# EAGLE design P2N-001 (EAGLE 7.1.0)
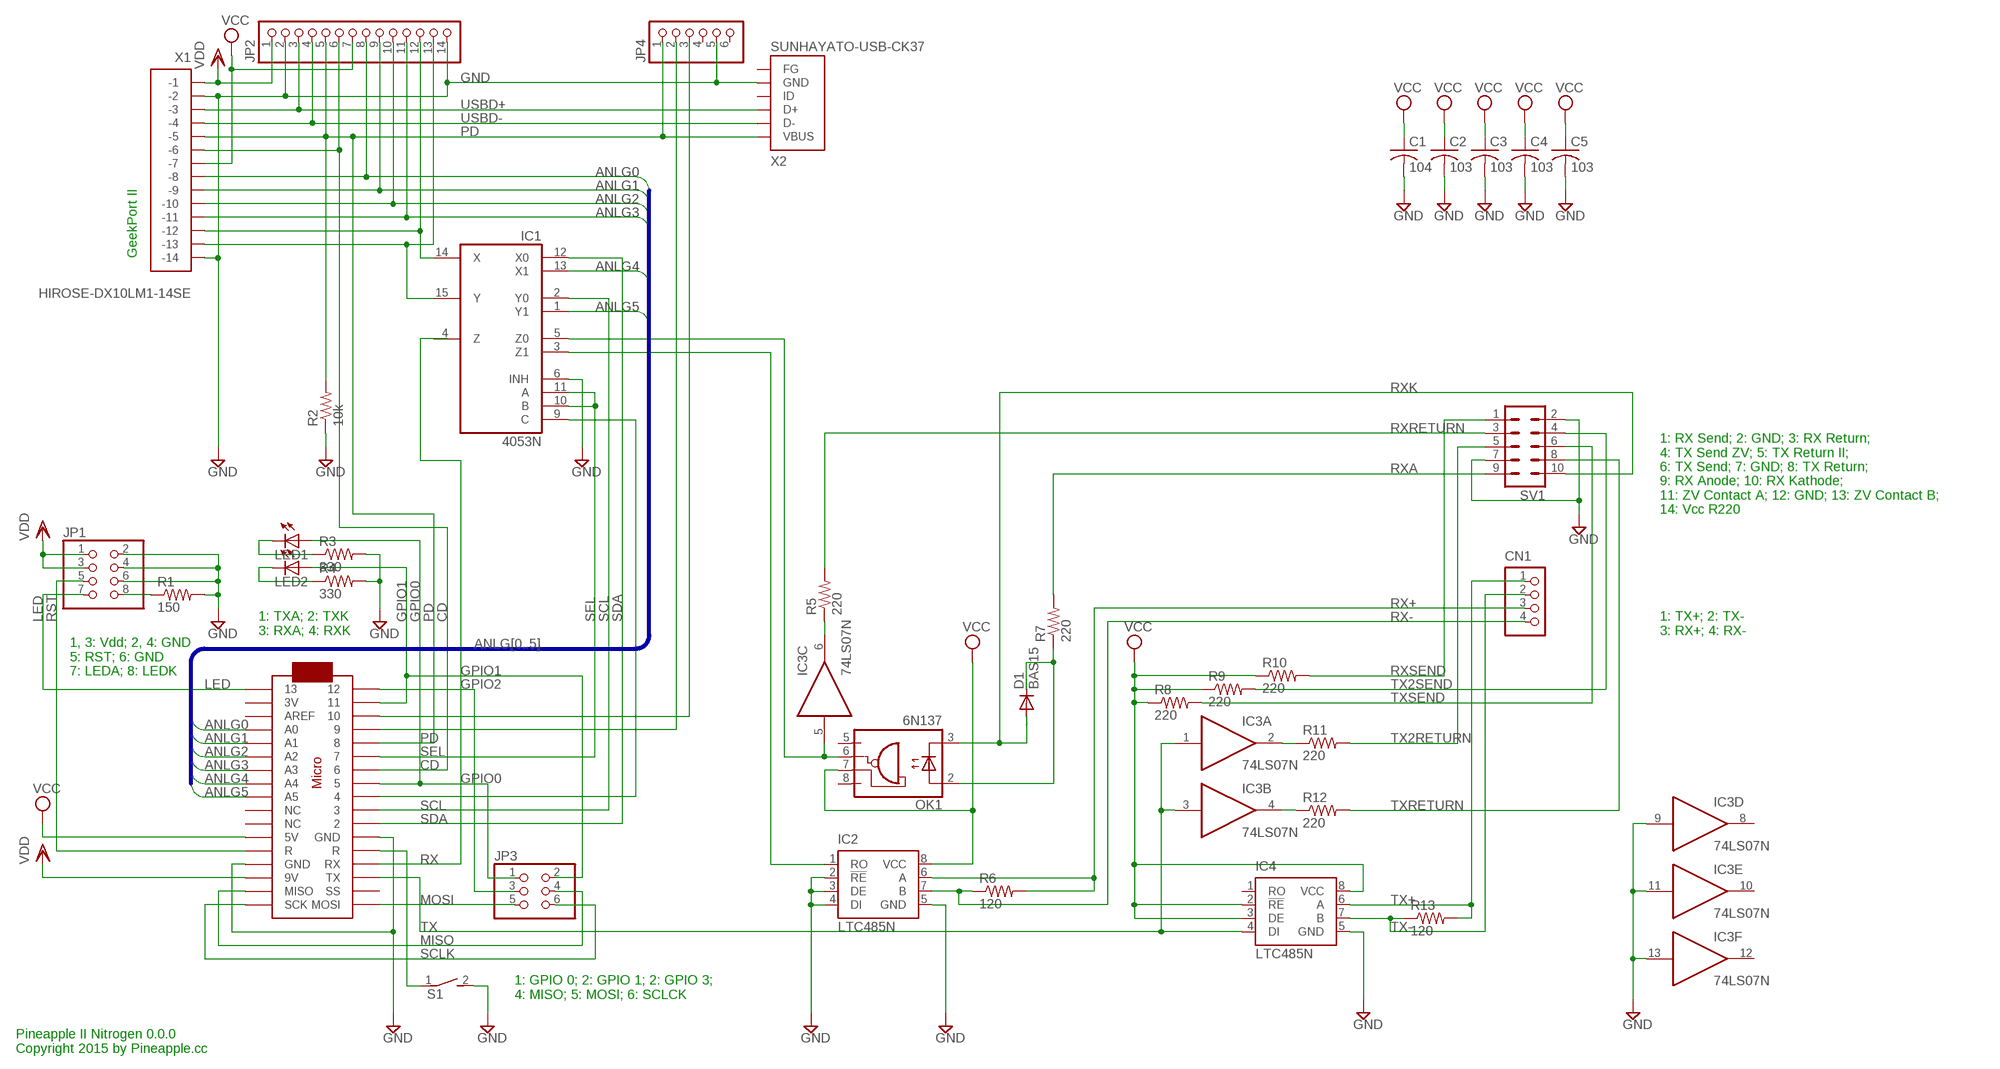
[diagram p0: schematic, sheet 1]

## Parts
C1  104  C-US025-025X050  [C025-025X050]
C2  103  C-US025-025X050  [C025-025X050]
C3  103  C-US025-025X050  [C025-025X050]
C4  103  C-US025-025X050  [C025-025X050]
C5  103  C-US025-025X050  [C025-025X050]
CN1  S4B-PH-K-S  [S4B-PH-K-S]
D1  BAS15  [DO34-7]
IC1  4053N  [DIL16]
IC2  LTC485N  [DIL08]
IC3  74LS07N  [DIL14]
IC4  LTC485N  [DIL08]
JP1  PINHD-2X4  [2X04]
JP2  PINHD-1X14-CB  [1X14-CB]
JP3  PINHD-2X3  [2X03]
JP4  PINHD-1X6  [1X06]
LED1  LED3MM  [LED3MM]
LED2  LED3MM  [LED3MM]
MC1  ARDUINOMICRO  [ARDUINOMICRO]
OK1  6N137  [DIL08]
R1  150  R-US_0204/5  [0204/5]
R2  10k  R-US_0204/5  [0204/5]
R3  330  R-US_0204/5  [0204/5]
R4  330  R-US_0204/5  [0204/5]
R5  220  R-US_0204/5  [0204/5]
R6  120  R-US_0204/5  [0204/5]
R7  220  R-US_0204/5  [0204/5]
R8  220  R-US_0204/5  [0204/5]
R9  220  R-US_0204/5  [0204/5]
R10  220  R-US_0204/5  [0204/5]
R11  220  R-US_0204/5  [0204/5]
R12  220  R-US_0204/5  [0204/5]
R13  120  R-US_0204/5  [0204/5]
S1  DS01E  [DS-01]
SV1  ML10L  [ML10L]
X1  HIROSE-DX10LM1-14SE  [HIROSE-DX10LM1-14SE]
X2  SUNHAYATO-USB-CK37  [SUNHAYATO-USB-CK37]

## Nets
ANLG0: JP2.8 MC1.P$31(A0) X1.P$8(-8)
ANLG1: JP2.9 MC1.P$30(A1) X1.P$9(-9)
ANLG2: JP2.10 MC1.P$29(A2) X1.P$10(-10)
ANLG3: JP2.11 MC1.P$28(A3) X1.P$11(-11)
ANLG4: IC1.13(X1) MC1.P$27(A4)
ANLG5: IC1.1(Y1) MC1.P$26(A5)
CD: JP2.6 MC1.P$7 X1.P$6(-6)
GND: C1.2 C2.2 C3.2 C4.2 C5.2 IC1.6(INH) IC2.2(!RE) IC2.3(DE) IC2.4(DI) IC2.5(GND) IC3.9(D:I) IC3.11(E:I) IC3.13(F:I) IC4.5(GND) JP1.2 JP1.4 JP1.6 JP2.2 JP2.14 JP4.5 MC1.P$12(GND) MC1.P$21(GND) R1.2 R2.1 R3.2 R4.2 S1.2 SV1.2 SV1.7 X1.P$2(-2) X1.P$14(-14) X2.P$5(GND)
GPIO0: JP3.1 LED1.A MC1.P$8
GPIO1: JP3.2 LED2.A MC1.P$2
GPIO2: JP3.3 MC1.P$1
LED: JP1.7 MC1.P$34
MIDIRX: IC1.5(Z0) IC3.5(C:I) OK1.6(VO)
MISO: JP3.4 MC1.P$19(MISO)
MOSI: JP3.5 MC1.P$17(MOSI)
N$1: MC1.P$22(R) S1.1
N$2: IC3.2(A:O) R11.1
N$3: IC3.6(C:O) R5.1
N$4: IC3.4(B:O) R12.1
N$5: JP4.2 MC1.P$4
N$6: JP4.3 MC1.P$3
N$8: IC1.9(C) MC1.P$9
N$15: D1.C OK1.2(A) R7.1
N$17: LED1.K(C) R3.1
N$18: LED2.K(C) R4.1
N$28: IC1.14(X) JP2.12 X1.P$12(-12)
N$29: IC1.15(Y) JP2.13 X1.P$13(-13)
N$32: JP1.8 R1.1
PD: JP2.5 JP4.1 MC1.P$5 R2.2 X1.P$5(-5) X2.P$1(VBUS)
RST: JP1.5 MC1.P$13(R)
RX: MC1.P$14(RX)
RX+: CN1.3 IC2.6(A) R6.2
RX-: CN1.4 IC2.7(B) R6.1
RXA: R7.2 SV1.9
RXK: D1.A OK1.3(C) SV1.10
RXRETURN: R5.2 SV1.3
RXSEND: R10.2 SV1.1
SCL: IC1.2(Y0) MC1.P$10
SCLK: JP3.6 MC1.P$18(SCK)
SDA: IC1.12(X0) MC1.P$11
SEL: IC1.10(B) IC1.11(A) MC1.P$6
TX: IC3.1(A:I) IC3.3(B:I) IC4.4(DI) MC1.P$15(TX)
TX2RETURN: R11.2 SV1.5
TX2SEND: R9.2 SV1.4
TX+: CN1.1 IC4.6(A) R13.2
TX-: CN1.2 IC4.7(B) R13.1
TXRETURN: R12.2 SV1.8
TXSEND: R8.2 SV1.6
USBD+: JP2.3 X1.P$3(-3) X2.P$3(D+)
USBD-: JP2.4 X1.P$4(-4) X2.P$2(D-)
VCC: C1.1 C2.1 C3.1 C4.1 C5.1 IC2.8(VCC) IC4.2(!RE) IC4.3(DE) IC4.8(VCC) JP2.7 MC1.P$23(5V) OK1.7(VE) R8.1 R9.1 R10.1 X1.P$7(-7)
VDD: JP1.1 JP1.3 JP2.1 MC1.P$20(9V) X1.P$1(-1)
XMIDIRX: IC1.3(Z1) IC2.1(RO)
Unconnected: IC1.4(Z) IC3.8(D:O) IC3.10(E:O) IC3.12(F:O) IC4.1(RO) JP4.4 JP4.6 MC1.P$16(SS) MC1.P$24(NC) MC1.P$25(NC) MC1.P$32(AREF) MC1.P$33(3V) OK1.5(GND) OK1.8(VCC) X2.P$4(ID) X2.P$6(FG)

## Buses
ANLG[0..5]

## Notes on the sheet
- GeekPort II
- 1: RX Send; 2: GND; 3: RX Return;
  4: TX Send ZV; 5: TX Return II;
  6: TX Send; 7: GND; 8: TX Return;
  9: RX Anode; 10: RX Kathode;
  11: ZV Contact A; 12: GND; 13: ZV Contact B;
  14: Vcc R220
- 1: TXA; 2: TXK
  3: RXA; 4: RXK
- 1: TX+; 2: TX-
  3: RX+; 4: RX-
- 1, 3: Vdd; 2, 4: GND
  5: RST; 6: GND
  7: LEDA; 8: LEDK
- 1: GPIO 0; 2: GPIO 1; 2: GPIO 3;
  4: MISO; 5: MOSI; 6: SCLCK
- Pineapple II Nitrogen 0.0.0
  Copyright 2015 by Pineapple.cc

## Power pins joined to a net without a drawn wire
GND: IC1.8(GND) IC3.7(P:GND)
VCC: IC1.16(VCC) IC3.14(P:VCC)
VEE: IC1.7(VEE)

## Library data of the parts
C1-C5 = rcl:C-US: CAPACITOR, American symbol
CN1 = jst-ph:S4B-PH-*: Wire-to-Board 2.0mm pitch side mount connector Source: http://www.jst-mfg.com/product/pdf/jpn/PH.pdf http://www.jst-mfg.com/product/detail.php?series=199
D1 = diode:BAS15: DIODE high speed
IC1 = 40xx:4053: Triple 2-channel ANALOG MULTIPLEXER
IC2 IC4 = linear-technology:LTC485: Low Power RS485 Interface Transceiver Source: http://www.linear.com/pc/downloadDocument.do?navId=H0,C1,C1007,C1017,P2064,D1718; OC_FARNELL: unknown; OC_NEWARK: unknown
IC3 = 74xx-us:74*07: Hex BUFFER, open collector high-voltage output
JP1 = pinhead:PINHD-2X4: PIN HEADER
JP2 = adafruit:PINHD-1X14: PIN HEADER
JP3 = pinhead:PINHD-2X3: PIN HEADER
JP4 = adafruit:PINHD-1X6: PIN HEADER
LED1 LED2 = led:LED: LED OSRAM: - CHIPLED LG R971, LG N971, LY N971, LG Q971, LY Q971, LO R971, LY R971 LH N974, LH R974 LS Q976, LO Q976, LY Q976 LO Q996 - Hyper CHIPLED LW Q18S LB Q993, LB Q99A, LB R99A - SideLED LS A670, LO A670, LY A670, LG A670, LP A670 LB A673, LV A673, LT A673, LW A673 LH A674 LY A675 LS A676, LA A676, LO A676, LY A676, LW A676 LS A679, LY A679, LG A679 - Hyper Micro SIDELED® LS Y876, LA Y876, LO Y876, LY Y876 LT Y87S - SmartLED LW L88C, LW L88S LB L89C, LB L89S, LG L890 LS L89K, LO L89K, LY L89K LS L896, LA L896, LO L896, LY L896 - TOPLED LS T670, LO T670, LY T670, LG T670, LP T670 LSG T670, LSP T670, LSY T670, LOP T670, LYG T670 LG T671, LOG T671, LSG T671 LB T673, LV T673, LT T673, LW T673 LH T674 LS T676, LA T676, LO T676, LY T676, LB T676, LH T676, LSB T676, LW T676 LB T67C, LV T67C, LT T67C, LS T67K, LO T67K, LY T67K, LW E67C LS E67B, LA E67B, LO E67B, LY E67B, LB E67C, LV E67C, LT E67C LW T67C LS T679, LY T679, LG T679 LS T770, LO T770, LY T770, LG T770, LP T770 LB T773, LV T773, LT T773, LW T773 LH T774 LS E675, LA E675, LY E675, LS T675 LS T776, LA T776, LO T776, LY T776, LB T776 LHGB T686 LT T68C, LB T68C - Hyper Mini TOPLED® LB M676 - Mini TOPLED Santana® LG M470 LS M47K, LO M47K, LY M47K Source: http://www.osram.convergy.de LUXEON: - LUMILED® LXK2-PW12-R00, LXK2-PW12-S00, LXK2-PW14-U00, LXK2-PW14-V00 LXK2-PM12-R00, LXK2-PM12-S00, LXK2-PM14-U00 LXK2-PE12-Q00, LXK2-PE12-R00, LXK2-PE12-S00, LXK2-PE14-T00, LXK2-PE14-U00 LXK2-PB12-K00, LXK2-PB12-L00, LXK2-PB12-M00, LXK2-PB14-N00, LXK2-PB14-P00, LXK2-PB14-Q00 LXK2-PR12-L00, LXK2-PR12-M00, LXK2-PR14-Q00, LXK2-PR14-R00 LXK2-PD12-Q00, LXK2-PD12-R00, LXK2-PD12-S00 LXK2-PH12-R00, LXK2-PH12-S00 LXK2-PL12-P00, LXK2-PL12-Q00, LXK2-PL12-R00 Source: www.luxeon.com KINGBRIGHT: KA-3528ASYC Source: www.kingbright.com
MC1 = adafruit:ARDUINOMICRO
OK1 = optocoupler:6N137: MOTOROLA OPTO COUPLER; MPN: 6N137; OC_FARNELL: 1328376; OC_NEWARK: 52M1895
R1-R13 = resistor:R-US_: RESISTOR, American symbol
S1 = switch-dil:DS01E: DIL/CODE SWITCH; OC_FARNELL: unknown; OC_NEWARK: unknown
SV1 = con-ml:ML10L: HARTING; OC_FARNELL: unknown; OC_NEWARK: unknown
X1 = con-hirose-dx10lm1-14se:HIROSE-DX10LM1-14SE: AXR30545 Plug (Board mounting type) B type Source: http://www.panasonic-electric-works.ch/home/www/catalogues/connector/download/en_ds_65201_0000.pdf; MPN: AXR30545; OC_FARNELL: unknown; OC_NEWARK: 11N4069
X2 = con-sunhayato-usb:SUNHAYATO-USB-CK37: AXR30545 Plug (Board mounting type) B type Source: http://www.panasonic-electric-works.ch/home/www/catalogues/connector/download/en_ds_65201_0000.pdf; MPN: AXR30545; OC_FARNELL: unknown; OC_NEWARK: 11N4069

## Board
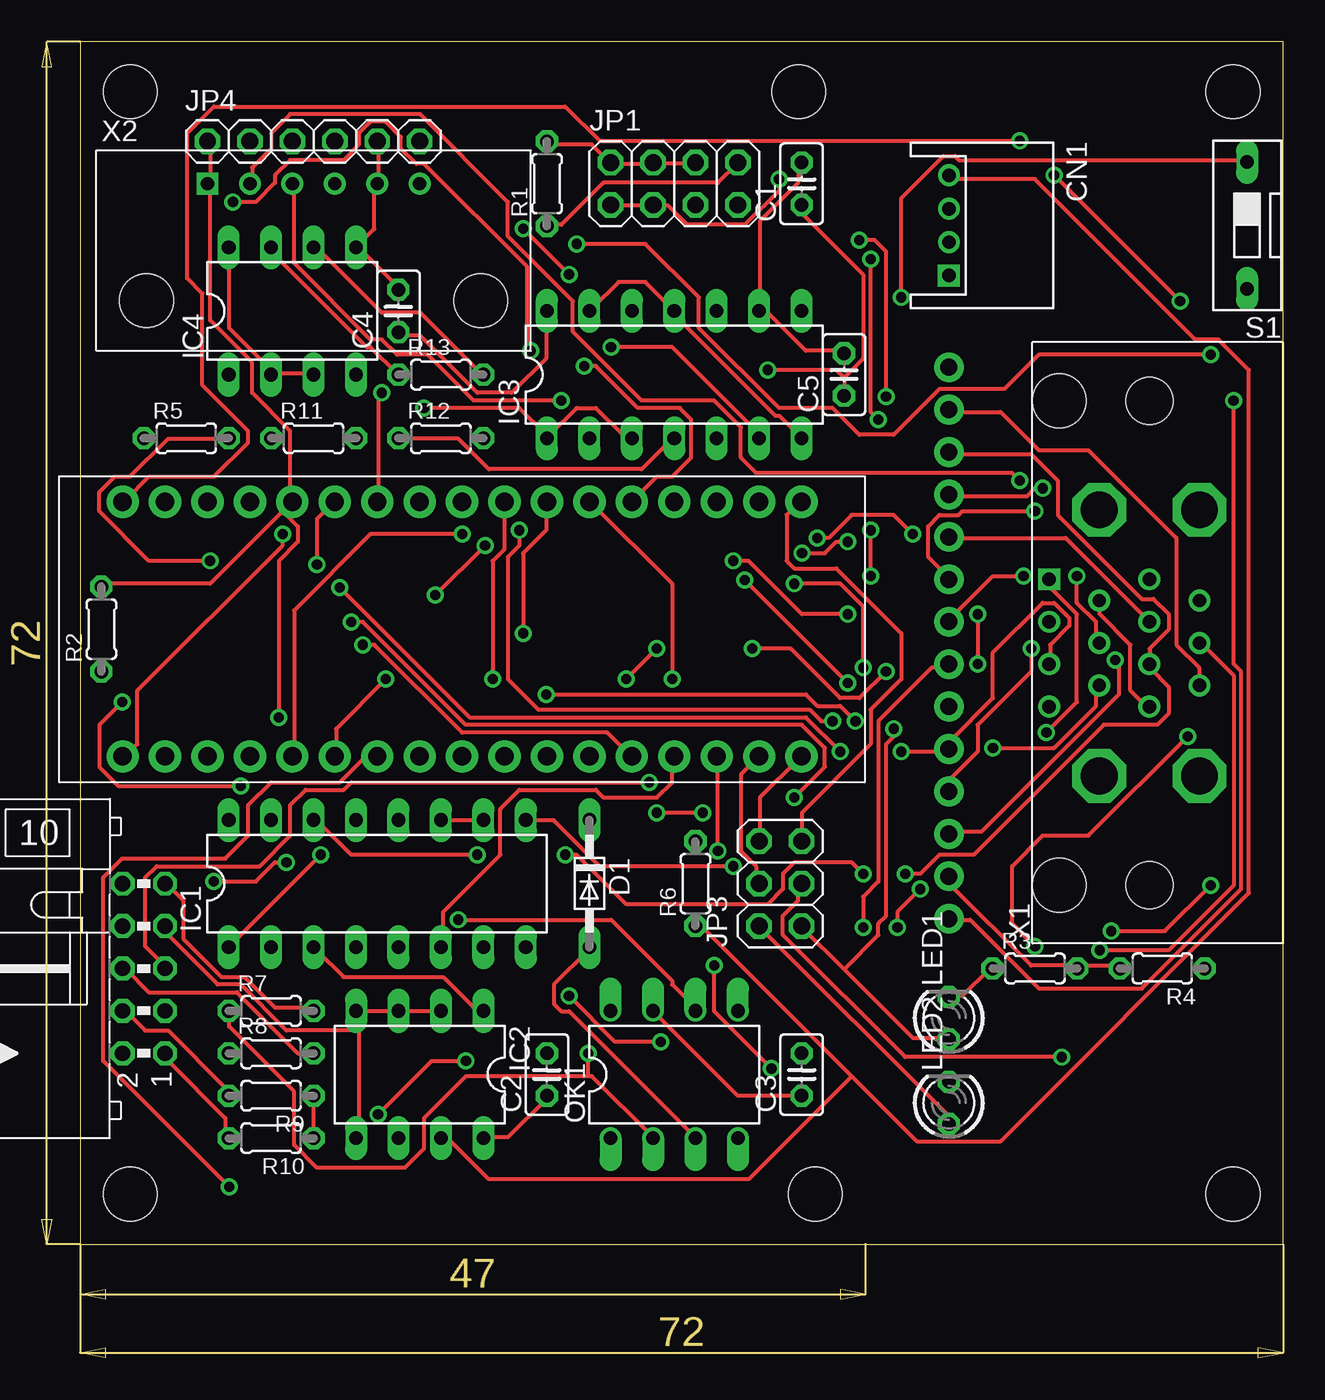
[diagram p1: board, top side]
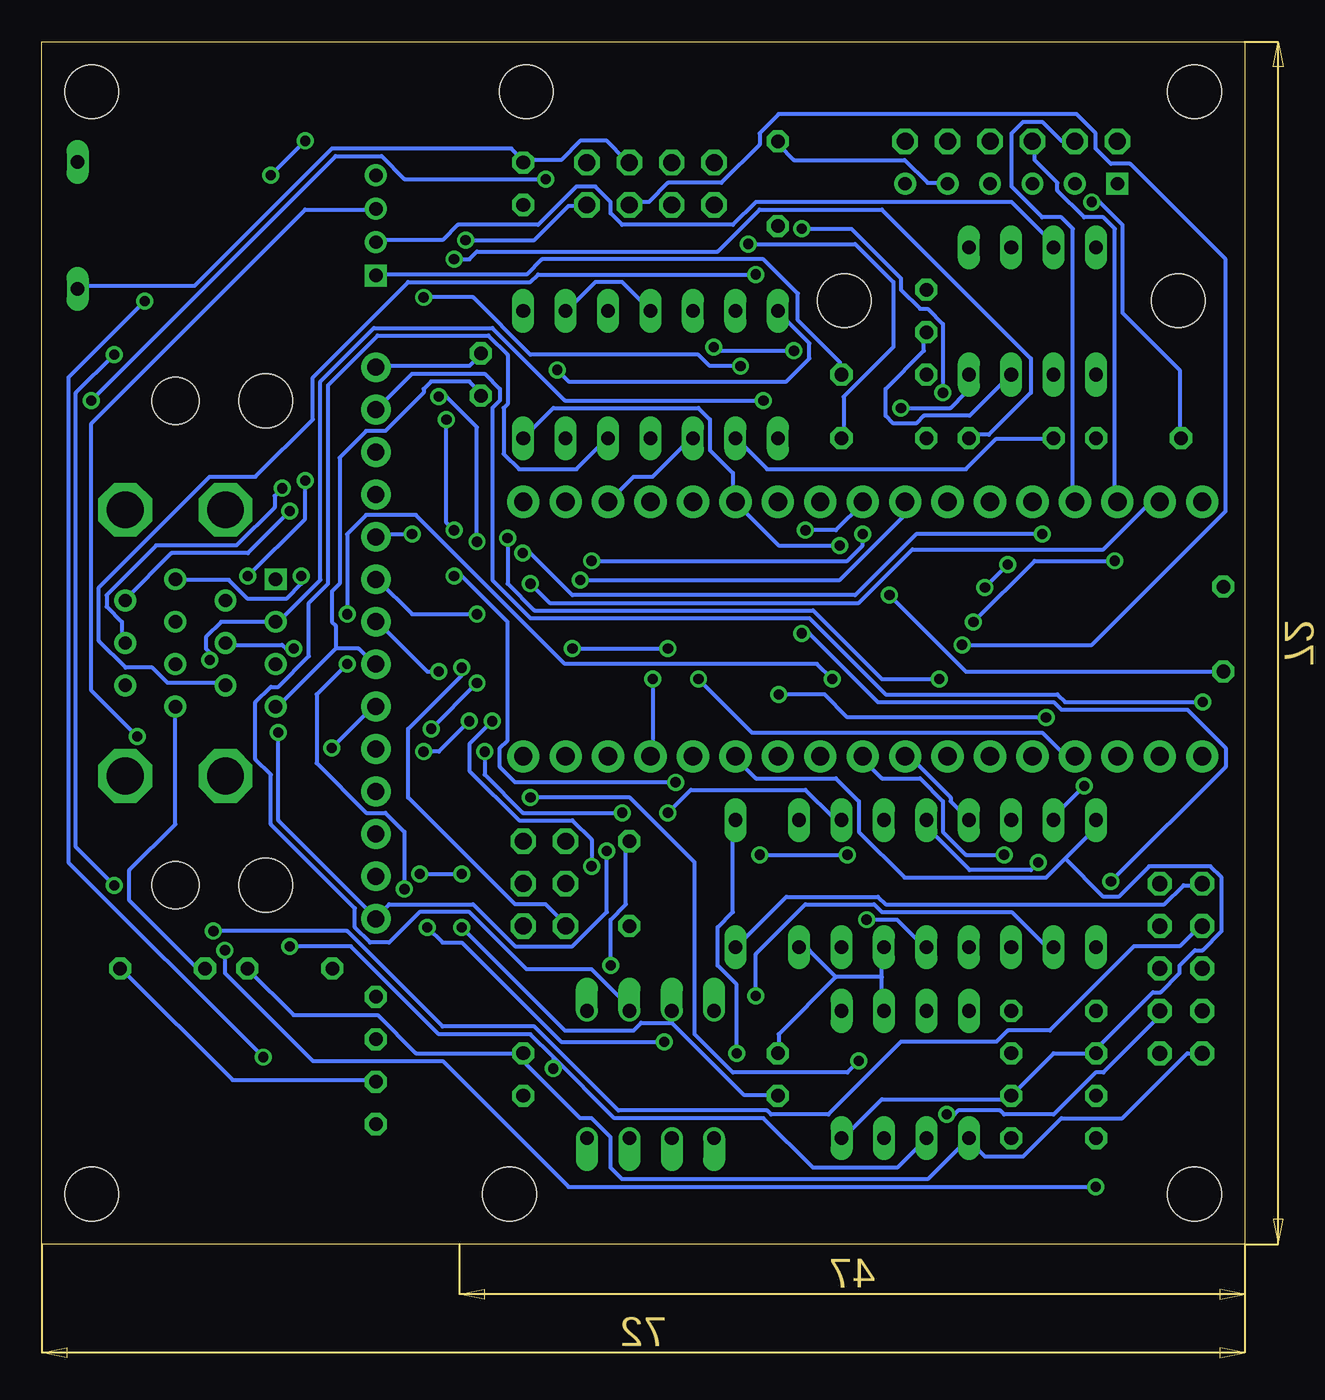
[diagram p2: board, bottom side, seen from below]

Size 72 x 72 mm. Coordinates in mm from the lower left corner, seen from the top.
Outline: 0,0 72,0 72,72 0,72 0,0
Copper layers (1*16): Top 0.035mm / dielectric 1.5mm / Bottom 0.035mm
Design rules "default": minimum track width 10mil, minimum drill 24mil, track to track 8mil, track to pad 8mil, pad to pad 8mil, via to via 8mil, smd to smd 8mil, copper to edge 40mil, drill to drill 8mil, minimum pad ring 10mil, minimum via ring 8mil, stop-mask expansion 4mil, vias tented up to drill 0mil, thermal gap 10mil
Holes 3.2 mm at 3,3 3,69 69,3 69,69 44,3 43,69

### Footprints (pad centres in the part's own frame; a part is rotated, then mirrored left to right if it is on the bottom)
C025-025X050 = drill 0.813 octagon: 1 -1.27,0; 2 1.27,0
S4B-PH-K-S = drill 0.8 square: 1 3,0 | drill 0.8: 2 1,0; 3 -1,0; 4 -3,0
DO34-7 = drill 0.813 long: A 3.81,0; C -3.81,0
DIL16 = drill 0.813 long: 1 -8.89,-3.81; 2 -6.35,-3.81; 3 -3.81,-3.81; 4 -1.27,-3.81; 5 1.27,-3.81; 6 3.81,-3.81; 7 6.35,-3.81; 8 8.89,-3.81; 9 8.89,3.81; 10 6.35,3.81; 11 3.81,3.81; 12 1.27,3.81; 13 -1.27,3.81; 14 -3.81,3.81; 15 -6.35,3.81; 16 -8.89,3.81
DIL08 = drill 0.813 long: 1 -3.81,-3.81; 2 -1.27,-3.81; 3 1.27,-3.81; 4 3.81,-3.81; 5 3.81,3.81; 6 1.27,3.81; 7 -1.27,3.81; 8 -3.81,3.81
DIL14 = drill 0.813 long: 1 -7.62,-3.81; 2 -5.08,-3.81; 3 -2.54,-3.81; 4 0,-3.81; 5 2.54,-3.81; 6 5.08,-3.81; 7 7.62,-3.81; 8 7.62,3.81; 9 5.08,3.81; 10 2.54,3.81; 11 0,3.81; 12 -2.54,3.81; 13 -5.08,3.81; 14 -7.62,3.81
2X04 = drill 1.016 octagon: 1 -3.81,-1.27; 2 -3.81,1.27; 3 -1.27,-1.27; 4 -1.27,1.27; 5 1.27,-1.27; 6 1.27,1.27; 7 3.81,-1.27; 8 3.81,1.27
1X14-CB = drill 1.016 pad 1.778: 1 -16.51,0; 2 -13.97,0; 3 -11.43,0; 4 -8.89,0; 5 -6.35,0; 6 -3.81,0; 7 -1.27,0; 8 1.27,0; 9 3.81,0; 10 6.35,0; 11 8.89,0; 12 11.43,0; 13 13.97,0; 14 16.51,0
2X03 = drill 1.016 octagon: 1 -2.54,-1.27; 2 -2.54,1.27; 3 0,-1.27; 4 0,1.27; 5 2.54,-1.27; 6 2.54,1.27
1X06 = drill 1.016 octagon: 1 -6.35,0; 2 -3.81,0; 3 -1.27,0; 4 1.27,0; 5 3.81,0; 6 6.35,0
LED3MM = drill 0.813 octagon: A -1.27,0; K 1.27,0
ARDUINOMICRO = drill 1.1 pad 1.93: P$1 -20.32,7.62; P$2 -17.78,7.62; P$3 -15.24,7.62; P$4 -12.7,7.62; P$5 -10.16,7.62; P$6 -7.62,7.62; P$7 -5.08,7.62; P$8 -2.54,7.62; P$9 0,7.62; P$10 2.54,7.62; P$11 5.08,7.62; P$12 12.7,-7.62; P$13 10.16,-7.62; P$14 12.7,7.62; P$15 15.24,7.62; P$16 17.78,7.62; P$17 20.32,7.62; P$18 20.32,-7.62; P$19 17.78,-7.62; P$20 15.24,-7.62; P$21 7.62,7.62; P$22 10.16,7.62; P$23 7.62,-7.62; P$24 5.08,-7.62; P$25 2.54,-7.62; P$26 0,-7.62; P$27 -2.54,-7.62; P$28 -5.08,-7.62; P$29 -7.62,-7.62; P$30 -10.16,-7.62; P$31 -12.7,-7.62; P$32 -15.24,-7.62; P$33 -17.78,-7.62; P$34 -20.32,-7.62
DIL08' = drill 0.813 offset: 1 -3.81,-3.81; 2 -1.27,-3.81; 3 1.27,-3.81; 4 3.81,-3.81; 5 3.81,3.81; 6 1.27,3.81; 7 -1.27,3.81; 8 -3.81,3.81
0204/5 = drill 0.813 octagon: 1 -2.54,0; 2 2.54,0
DS-01 = drill 0.813 long: 1 0,-3.81; 2 0,3.81
ML10L = drill 0.914 octagon: 1 -5.08,-1.27; 2 -5.08,1.27; 3 -2.54,-1.27; 4 -2.54,1.27; 5 0,-1.27; 6 0,1.27; 7 2.54,-1.27; 8 2.54,1.27; 9 5.08,-1.27; 10 5.08,1.27
HIROSE-DX10LM1-14SE = drill 0.8 square: P$1 3.81,9 | drill 0.8: P$2 2.54,6; P$3 1.27,9; P$4 0,6; P$5 -1.27,9; P$6 -2.54,6; P$7 -3.81,9; P$8 3.81,3; P$9 2.54,0; P$10 1.27,3; P$11 0,0; P$12 -1.27,3; P$13 -2.54,0; P$14 -3.81,3 | drill 2.2 octagon: P$15 -7.97,0; P$16 7.97,0; P$17 7.97,6; P$18 -7.97,6 | hole 2.8: -14.5,3; 14.5,3 | hole 3.2: -14.5,8.4; 14.5,8.4
SUNHAYATO-USB-CK37 = drill 0.8 square: P$1 -6.35,0 | drill 0.8: P$2 -3.81,0; P$3 -1.27,0; P$4 1.27,0; P$5 3.81,0; P$6 6.35,0 | hole 3.2: -10,-7; 10,-7

### Placement (x,y rotation side)
C1  43.18,63.5 90 top
C2  27.94,10.16 90 top
C3  43.18,10.16 90 top
C4  19.05,55.88 90 top
C5  45.72,52.07 90 top
CN1  52,61 270 top
D1  30.48,21.59 270 top
IC1  17.78,21.59 0 top
IC2  20.32,10.16 180 top
IC3  35.56,52.07 0 top
IC4  12.7,55.88 0 top
JP1  35.56,63.5 0 top
JP2  52,36 90 top
JP3  41.91,21.59 90 top
JP4  13.97,66.04 0 top
LED1  52,13.54 90 top
LED2  52,8.46 90 top
MC1  22.86,36.83 0 top
OK1  6N137  [DIL08']  35.56,10.16 0 top
R1  27.94,63.5 90 top
R2  1.27,36.83 90 top
R3  57.15,16.51 0 top
R4  64.77,16.51 180 top
R5  6.35,48.26 0 top
R6  36.83,21.59 90 top
R7  11.43,13.97 0 top
R8  11.43,11.43 0 top
R9  11.43,8.89 180 top
R10  11.43,6.35 180 top
R11  13.97,48.26 0 top
R12  21.59,48.26 0 top
R13  21.59,52.07 0 top
S1  69.85,61 180 top
SV1  3.81,16.51 90 top
X1  67,36 90 top
X2  13.97,63.5 0 top

### Tracks (layer width: path | path; a pad name or v marks a point on that pad's centre or on a via)
ANLG0  (via drill 0.61)
  Top 0.254: v56.46,40.01 54.63,40.01 52.12,37.49 JP2.8 | v34.52,35.66 v32.69,33.83 | v40.23,35.66 42.52,35.66 45.49,32.69 46.63,32.69 v48.23,34.29
  Bottom 0.254: v56.46,40.01 56.46,39.55 57.38,38.63 59.66,38.63 60.81,39.78 63.78,39.78 X1.P$8 | v32.69,33.83 29.49,30.63 12.12,30.63 10.74,29.26 10.29,29.26 MC1.P$31 | v40.23,35.66 v34.52,35.66 | v48.23,34.29 48.92,34.29 51.89,37.26 JP2.8
ANLG1  (via drill 0.61)
  Top 0.254: v57.15,43.89 52.81,43.89 52.58,43.66 51.44,43.66 50.75,42.98 50.75,41.15 51.89,40.01 JP2.9 | v22.86,42.52 17.37,42.52 12.8,37.95 12.8,29.26 MC1.P$30 | v39.09,40.92 40.01,40.92 43.2,37.72 v45.95,37.72
  Bottom 0.254: v57.15,43.89 59.66,41.38 64.24,41.38 66.98,38.63 X1.P$9 | v22.86,42.52 22.86,41.83 23.77,40.92 v39.09,40.92 | v45.95,37.72 49.84,37.72 51.89,39.78 JP2.9
ANLG2  (via drill 0.61)
  Top 0.254: X1.P$10 63.78,37.49 58.98,42.29 52.12,42.29 JP2.10 | v18.29,33.83 15.32,30.86 15.32,29.26 MC1.P$29 | v44.12,42.29 44.81,42.29 46.18,43.66 48.69,43.66 v49.84,42.52
  Bottom 0.254: v18.29,33.83 21.72,33.83 25.83,37.95 42.52,37.95 44.12,39.55 v44.12,42.29 | v49.84,42.52 51.89,42.52 JP2.10
ANLG3  (via drill 0.61)
  Top 0.254: v57.61,45.26 57.15,45.26 56.69,44.81 52.12,44.81 JP2.11 | v8.91,3.43 1.37,10.97 1.37,21.95 2.52,23.09 8.69,23.09 10.06,24.46 10.06,26.29 11.43,27.66 15.54,27.66 16.92,29.03 17.6,29.03 MC1.P$28 | v61.04,17.6 65.15,17.6 69.04,21.49 69.04,34.06 67.21,35.89 X1.P$11
  Bottom 0.254: v57.61,45.26 58.06,44.81 58.06,44.12 60.35,41.83 65.15,41.83 68.12,38.86 68.12,38.18 67.21,37.26 67.21,36.12 X1.P$11 | v8.91,3.43 40.46,3.43 48.01,10.97 55.78,10.97 61.04,16.23 v61.04,17.6
ANLG4
  Bottom 0.254: IC1.13 16.69,25.6 17.6,26.52 17.6,26.75 20.12,29.26 MC1.P$27
ANLG5  (via drill 0.61)
  Top 0.254: v14.4,23.32 8.91,17.83 IC1.1
  Bottom 0.254: v14.4,23.32 16.69,23.32 18.06,24.69 18.06,26.52 19.43,27.89 21.72,27.89 22.86,29.03 MC1.P$26
CD  (via drill 0.61)
  Top 0.254: v54.63,29.72 58.29,29.72 60.81,32.23 60.81,33.38 X1.P$6 | v18.06,50.98 17.83,50.75 17.83,44.58 MC1.P$7 | v29.26,58.06 v26.52,60.81
  Bottom 0.254: v54.63,29.72 52.12,32.23 JP2.6 | v18.06,50.98 18.06,55.09 18.97,56.01 19.43,56.01 20.57,57.15 20.57,57.84 23.55,60.81 v26.52,60.81 | v29.26,58.06 42.29,58.06 42.75,57.61 50.06,57.61 55.78,51.89 55.78,49.38 59.21,45.95 61.95,45.95 68.58,39.32 68.58,36.12 66.98,34.52 65.38,34.52 64.47,33.6 61.04,33.6 X1.P$6
GND  (via drill 0.61)
  Top 0.254: X1.P$2 61.04,38.41 61.04,37.72 62.87,35.89 62.87,33.15 63.78,32.23 X1.P$14 | R4.2 62.18,16.69 59.89,16.69 R3.2 59.66,16.69 56.92,16.69 52.12,21.49 52.12,21.95 JP2.2 | 16.69,13.95 16.69,12.8 | 16.69,12.8 16.69,6.4 IC2.5 | 16.69,12.8 12.34,12.8 9.6,15.54 8.23,15.54 5.26,18.52 5.26,18.97 SV1.7 | 16.69,12.8 IC2.4 16.69,13.95 | IC2.2 21.49,13.95 19.2,13.95 IC2.3 18.97,13.95 16.69,13.95 | MC1.P$12 35.43,29.03 35.43,27.66 34.52,26.75 31.32,26.75 30.86,27.2 26.29,27.2 25.15,26.06 25.15,23.32 21.72,19.89 21.72,17.83 IC1.6 | v24.23,41.83 v21.26,38.86 | C5.2 45.72,53.49 43.43,53.49 41.15,55.78 40.69,55.78 IC3.9 40.69,56.01 40.69,61.27 42.98,63.55 42.98,64.69 C1.2 | IC3.13 30.63,56.01 32.23,57.61 33.83,57.61 IC3.11 35.43,55.78 41.6,49.61 41.83,49.61 IC3.7 | JP4.5 17.83,65.84 17.83,63.55 X2.P$5 17.6,63.32 17.6,60.81 16.69,59.89 IC4.5 16.69,59.66 19.2,57.15 C4.2 | R1.2 28.12,65.84 30.63,65.84 31.55,64.92 JP1.2 31.77,64.69 34.29,64.69 | 34.29,64.69 36.8,64.69 JP1.6 | 34.29,64.69 JP1.4 | v35.43,33.83 35.43,39.55 30.63,44.35 MC1.P$21
  Bottom 0.254: R3.2 59.66,16.46 56.92,13.72 51.89,13.72 49.61,11.43 C3.2 42.98,11.43 42.98,10.74 39.78,7.54 39.09,7.54 37.95,6.4 37.95,4.57 37.26,3.89 18.97,3.89 IC2.5 16.46,6.17 15.54,5.26 13.26,5.26 10.97,7.54 7.32,7.54 3.43,11.43 SV1.2 | X1.P$14 64.01,32 64.01,25.15 66.75,22.4 66.75,20.57 62.87,16.69 62.41,16.69 R4.2 | 21.72,16 21.72,14.17 IC2.2 | 21.72,16 21.72,17.6 IC1.6 | 24.46,16 26.06,17.6 26.52,17.6 IC1.8 | 21.72,16 24.46,16 | 24.46,16 27.89,12.57 27.89,11.43 C2.2 | R2.1 16.69,34.29 v21.26,38.86 | v24.23,41.83 27.89,41.83 30.4,44.35 MC1.P$21 30.63,44.58 30.63,46.18 32,47.55 32,49.38 32.69,50.06 41.38,50.06 IC3.7 | JP2.14 51.89,52.58 46.41,52.58 45.72,53.26 C5.2 | IC3.9 40.46,56.01 38.86,57.61 37.26,57.61 35.66,56.01 IC3.11 | JP1.6 37.03,64.92 38.18,66.06 39.78,66.06 40.92,64.92 42.98,64.92 C1.2 43.2,64.92 43.89,65.61 54.63,65.61 62.87,57.38 69.72,57.38 S1.2 | X2.P$5 17.83,63.55 18.97,63.55 20.34,64.92 26.98,64.92 27.89,65.84 R1.2 | v35.43,33.83 35.43,29.26 MC1.P$12
GPIO0  (via drill 0.61)
  Top 0.254: 45.72,16.46 43.2,18.97 JP3.1 | 45.72,16.46 49.84,12.34 51.89,12.34 LED1.A | v45.95,33.6 v39.78,39.78 | v48.69,30.86 48.69,30.4 48.23,29.95 48.23,19.66 47.78,19.2 47.78,18.52 45.72,16.46
  Bottom 0.254: v39.78,39.78 24.23,39.78 20.34,43.66 20.34,44.35 MC1.P$8 | v48.69,30.86 v45.95,33.6
GPIO1  (via drill 0.61)
  Top 0.254: LED2.A 51.89,7.32 51.89,7.77 40.69,18.97 JP3.2 | v42.75,39.55 45.49,39.55 46.86,38.18 v46.86,34.52
  Bottom 0.254: v42.75,39.55 41.6,38.41 23.09,38.41 19.89,41.6 8.46,41.6 5.71,44.35 5.26,44.35 MC1.P$2 | v46.86,34.52 46.86,34.06 50.06,30.86 50.06,26.75 43.66,20.34 41.83,20.34 40.69,19.2 JP3.2
GPIO2  (via drill 0.61)
  Top 0.254: v58.75,11.2 49.38,11.2 42.06,18.52 42.06,19.66 42.98,20.57 42.98,21.49 JP3.3 | v58.29,64.01 v65.84,56.46 | v56.24,66.06 31.09,66.06 29.03,68.12 8,68.12 6.4,66.52 6.4,57.84 7.32,56.92 7.32,51.44 10.06,48.69 10.06,48.01 8,45.95 4.12,45.95 2.74,44.58 MC1.P$1
  Bottom 0.254: v58.75,11.2 70.41,22.86 70.41,51.89 v65.84,56.46 | v56.24,66.06 v58.29,64.01
LED  (via drill 0.61)
  Top 0.254: v46.63,60.12 47.55,60.12 48.23,59.44 v48.23,50.75 | v45.95,42.06 45.26,42.06 44.58,41.38 v43.2,41.38 | v12.12,42.52 12.12,41.83 3.43,33.15 3.43,29.95 2.74,29.26 MC1.P$34
  Bottom 0.254: v46.63,60.12 42.52,60.12 40.46,62.18 39.55,62.18 JP1.7 | v48.23,50.75 47.78,50.75 45.95,48.92 v45.95,42.06 | v43.2,41.38 42.75,41.38 40.23,38.86 23.32,38.86 19.66,42.52 v12.12,42.52
MIDIRX  (via drill 0.61)
  Top 0.254: v22.63,19.43 31.77,19.43 35.43,15.77 35.43,15.54 36.8,14.17 OK1.6
  Bottom 0.254: v22.63,19.43 20.8,19.43 19.2,17.83 IC1.5 | IC3.5 38.18,48.23 40.01,46.41 43.43,46.41 44.35,47.32 44.35,50.06 44.12,50.29 44.12,53.26 45.26,54.41 51.89,54.41 54.86,51.44 54.86,39.55 56.01,38.41 56.01,35.2 57.84,33.38 58.29,33.38 59.21,32.46 59.21,29.03 58.29,28.12 58.29,25.15 53.26,20.12 53.26,18.97 52.35,18.06 51.21,18.06 49.38,19.89 46.41,19.89 42.98,16.46 39.09,16.46 36.8,14.17 OK1.6
MISO
  Top 0.254: MC1.P$19 39.55,28.12 39.55,23.55 40.46,22.63 40.46,21.72 JP3.4
MOSI
  Top 0.254: JP3.5 43.2,24.23 43.2,25.83 47.32,29.95 47.32,32 49.15,33.83 49.15,36.58 45.26,40.46 42.75,40.46 42.29,40.92 42.29,43.66 42.98,44.35 MC1.P$17
N$1  (via drill 0.61)
  Top 0.254: v49.15,56.69 49.15,62.64 51.66,65.15 52.35,65.15 52.58,64.92 69.72,64.92 S1.1 | v30.18,52.58 30.86,52.58 33.38,50.06 35.89,50.06 36.58,49.38 36.58,47.09 35.43,45.95 34.52,45.95 MC1.P$22
  Bottom 0.254: v49.15,56.69 46.18,56.69 42.75,53.26 32.69,53.26 32,52.58 v30.18,52.58
N$2
  Bottom 0.254: R11.1 11.43,48.23 14.86,48.23 16.69,46.41 28.57,46.41 30.4,48.23 IC3.2
N$3  (via drill 0.61)
  Top 0.254: v9.14,62.41 10.52,62.41 11.66,63.55 11.66,64.01 12.57,64.92 15.77,64.92 16.69,65.84 16.69,66.52 17.37,67.21 18.29,67.21 19.2,66.29 19.2,65.61 20.12,64.69 20.57,64.69 26.75,58.52 26.75,53.72 v26.98,53.49 | v31.77,53.72 35.43,53.72 40.69,48.46 IC3.6
  Bottom 0.254: v9.14,62.41 8.69,62.41 7.32,61.04 7.32,55.78 3.89,52.35 3.89,48.46 R5.1 | v26.98,53.49 31.55,53.49 v31.77,53.72
N$4
  Top 0.254: R12.1 19.2,48.23 22.63,48.23 24.46,46.41 33.6,46.41 35.43,48.23 IC3.4
N$5
  Bottom 0.254: JP4.2 10.29,66.06 10.97,66.06 12.12,67.21 13.26,67.21 13.95,66.52 13.95,63.32 12.12,61.49 10.97,61.49 10.29,60.81 10.29,44.58 MC1.P$4
N$6
  Bottom 0.254: JP4.3 12.57,65.84 12.57,64.92 11.2,63.55 11.2,63.09 9.6,61.49 8.46,61.49 7.77,60.81 7.77,44.58 MC1.P$3
N$8  (via drill 0.61)
  Top 0.254: v39.09,22.63 31.09,22.63 28.35,25.38 26.75,25.38 IC1.9 | v45.03,31.32 44.35,31.32 43.66,32 27.43,32 25.6,33.83 25.6,41.15 26.29,41.83 v26.29,42.75
  Bottom 0.254: v39.09,22.63 39.09,24.23 40.23,25.38 43.43,25.38 46.41,28.35 46.41,29.95 v45.03,31.32 | v26.29,42.75 24.46,42.75 22.86,44.35 MC1.P$9
N$15  (via drill 0.61)
  Top 0.254: 30.4,10.06 30.63,10.06 34.29,6.4 OK1.2 | 30.4,10.06 23.09,10.06 20.57,7.54 20.57,5.71 19.43,4.57 14.17,4.57 12.8,5.94 12.8,9.14 8.91,13.03 8.91,13.95 R7.1 | 30.4,10.06 v30.4,11.43
  Bottom 0.254: v30.4,11.43 30.4,15.54 31.55,16.69 31.55,18.97 30.63,19.89 30.63,25.38 D1.C
N$17
  Top 0.254: LED1.K 52.12,14.86 52.81,14.86 54.41,16.46 R3.1
N$18
  Bottom 0.254: LED2.K 52.12,9.83 60.58,9.83 67.21,16.46 R4.1
N$28  (via drill 0.61)
  Top 0.254: JP2.12 52.12,47.32 56.92,47.32 58.52,45.72 58.52,43.66 63.55,38.63 64.24,38.63 65.15,37.72 65.15,36.8 64.01,35.66 64.01,34.75 X1.P$12 64.01,34.52 65.15,33.38 65.15,31.77 64.47,31.09 61.27,31.09 53.49,23.32 51.44,23.32 50.29,22.17 v49.38,22.17 | v23.77,23.32 16.23,23.32 14.17,25.38 IC1.14 | v29.03,23.32 29.72,23.32 32.69,20.34 41.15,20.34 42.06,21.26 42.06,22.17 42.75,22.86 46.18,22.86 v46.86,22.17
  Bottom 0.254: v29.03,23.32 v23.77,23.32 | v49.38,22.17 v46.86,22.17
N$29  (via drill 0.61)
  Top 0.254: X1.P$13 66.98,33.6 66.98,34.52 65.61,35.89 65.61,42.29 60.35,47.55 57.38,47.55 55.09,49.84 52.12,49.84 JP2.13 | v9.6,27.43 2.29,27.43 1.14,28.57 1.14,31.09 v2.52,32.46
  Bottom 0.254: v9.6,27.43 11.43,25.6 IC1.15 | v2.52,32.46 10.74,32.46 11.2,32.92 21.49,32.92 26.06,37.49 42.75,37.49 45.03,39.78 45.03,50.06 44.58,50.52 44.58,51.21 45.49,52.12 49.84,52.12 51.89,50.06 JP2.13
N$32
  Top 0.254: R1.1 28.12,61.04 28.8,61.04 31.32,63.55 38.18,63.55 39.32,64.69 JP1.8
PD  (via drill 0.61)
  Top 0.254: X1.P$5 58.06,34.75 58.06,35.89 59.21,37.03 59.21,37.49 58.29,38.41 57.61,38.41 54.63,35.43 54.63,32.69 52.12,30.18 52.12,29.72 JP2.5 51.89,29.49 v49.15,29.49 | JP4.1 7.77,65.84 7.77,63.55 X2.P$1 7.77,63.32 7.77,55.32 10.29,52.81 10.29,50.98 12.57,48.69 12.57,44.58 MC1.P$5 | 12.12,43.89 12.57,44.35 MC1.P$5 | 12.12,43.89 7.77,39.55 1.37,39.55 R2.2 | v46.41,31.32 45.49,32.23 44.12,32.23 43.43,32.92 v27.89,32.92 | v11.89,31.55 11.89,40.92 13.03,42.06 13.03,42.98 12.12,43.89 | 12.12,43.89 MC1.P$5
  Bottom 0.254: v49.15,29.49 48.23,29.49 v46.41,31.32 | v27.89,32.92 25.15,32.92 23.77,31.55 v11.89,31.55
RST  (via drill 0.61)
  Top 0.254: v16.92,35.89 17.6,35.89 22.86,30.63 31.55,30.63 32.92,29.26 MC1.P$13
  Bottom 0.254: v16.92,35.89 9.14,35.89 1.14,43.89 1.14,58.98 6.86,64.69 8,64.69 8.91,65.61 8.91,66.52 10.06,67.67 27.89,67.67 29.03,66.52 29.03,65.84 31.32,63.55 34.52,63.55 35.66,62.41 36.8,62.41 JP1.5
RX+  (via drill 0.61)
  Top 0.254: v66.29,30.4 60.35,24.46 57.61,24.46 55.78,22.63 55.78,19.2 v57.15,17.83 | v37.95,16.69 37.95,13.95 v41.38,10.52
  Bottom 0.254: v66.29,30.4 69.04,33.15 69.04,49.15 56.24,61.95 52.12,61.95 CN1.3 | v57.15,17.83 53.49,17.83 48.23,12.57 42.75,12.57 41.38,11.2 | 41.38,11.2 37.72,7.54 28.8,7.54 25.83,4.57 20.8,4.57 19.2,6.17 IC2.6 | v37.95,16.69 37.95,19.43 37.03,20.34 37.03,24 R6.2 | 41.38,11.2 v41.38,10.52
RX-
  Top 0.254: 46.18,10.06 37.03,19.2 R6.1 | 46.18,10.06 50.06,6.17 55.09,6.17 69.95,21.03 69.95,52.35 68.12,54.18 66.75,54.18 57.15,63.78 52.12,63.78 CN1.4 | 46.18,10.06 40.01,3.89 24.46,3.89 22.17,6.17 21.72,6.17 IC2.7
RXA
  Top 0.254: R7.2 13.95,14.17 11.66,14.17 9.83,16 8.46,16 6.17,18.29 6.17,20.57 5.26,21.49 SV1.9
RXK
  Top 0.254: OK1.3 36.8,6.4 29.26,13.95 28.8,13.95 28.35,14.4 28.35,15.54 30.4,17.6 D1.A
  Bottom 0.254: SV1.10 2.74,21.49 3.66,21.49 4.8,20.34 21.49,20.34 21.95,20.8 27.43,20.8 30.4,17.83 D1.A
RXRETURN  (via drill 0.61)
  Top 0.254: v7.77,40.92 4.12,40.92 1.14,43.89 1.14,45.03 2.06,45.95 2.97,45.95 5.26,48.23 8.69,48.23 R5.2 | v16.23,37.26 16.92,37.26 23.09,31.09 43.2,31.09 44.58,29.72 44.58,28.57 v42.75,26.75 | v23.09,10.97 21.03,10.97 v17.83,7.77
  Bottom 0.254: v7.77,40.92 12.57,40.92 v16.23,37.26 | v42.75,26.75 36.8,26.75 32.92,22.86 32.92,12.57 30.63,10.29 23.77,10.29 v23.09,10.97 | v17.83,7.77 17.37,7.77 17.14,8 14.63,8 14.4,7.77 11.43,7.77 8.91,10.29 8.46,10.29 5.26,13.49 5.26,13.95 SV1.3
RXSEND
  Top 0.254: R10.2 8.69,6.4 8.69,7.54 5.26,10.97 5.26,11.43 SV1.1
SCL  (via drill 0.61)
  Top 0.254: v29.26,14.86 32,12.12 v34.75,12.12 | v48.92,18.97 48.92,19.89 v50.29,21.26 | v53.72,37.72 v53.72,34.75 | v24.69,33.83 24.69,40.92 25.38,41.6 25.38,44.35 MC1.P$10
  Bottom 0.254: v29.26,14.86 29.26,17.37 26.29,20.34 22.17,20.34 21.72,19.89 13.95,19.89 11.89,17.83 11.43,17.83 IC1.2 | v34.75,12.12 40.92,12.12 46.86,18.06 48.01,18.06 v48.92,18.97 | v50.29,21.26 50.29,24.69 51.44,25.83 52.58,25.83 55.55,28.8 55.55,32.92 v53.72,34.75 | v53.72,37.72 53.72,42.52 52.58,43.66 49.61,43.66 40.69,34.75 25.6,34.75 v24.69,33.83
SCLK
  Top 0.254: JP3.6 40.69,24.23 40.69,26.75 42.98,29.03 MC1.P$18
SDA  (via drill 0.61)
  Top 0.254: v12.34,22.86 11.66,22.86 10.52,21.72 v8,21.72 | v26.52,36.58 26.52,41.38 27.89,42.75 27.89,44.35 MC1.P$11
  Bottom 0.254: v12.34,22.86 12.8,22.4 16.46,22.4 18.97,24.92 18.97,25.38 IC1.12 | v8,21.72 1.14,28.57 1.14,29.72 3.43,32 10.97,32 11.43,32.46 21.95,32.46 26.06,36.58 v26.52,36.58
SEL  (via drill 0.61)
  Top 0.254: IC1.11 21.72,25.38 24,25.38 IC1.10 | v37.26,25.83 v34.52,25.83 | v45.49,29.49 43.43,31.55 23.32,31.55 v15.54,39.32 | v14.17,40.69 14.17,43.43 15.09,44.35 MC1.P$6
  Bottom 0.254: v34.52,25.83 33.15,27.2 26.29,27.2 24.69,25.6 24.23,25.6 IC1.10 | v37.26,25.83 43.2,25.83 45.49,28.12 v45.49,29.49 | v14.17,40.69 v15.54,39.32
TX  (via drill 0.61)
  Top 0.254: v20.57,50.06 26.29,50.06 27.89,48.46 IC3.1 28.12,48.46 29.72,50.06 30.86,50.06 32.46,48.46 32.92,48.46 IC3.3
  Bottom 0.254: IC3.3 33.15,48.23 35.43,45.95 36.58,45.95 37.95,44.58 MC1.P$15 | v20.57,50.06 17.6,50.06 16.69,50.98 16.69,51.89 IC4.4
TX2RETURN  (via drill 0.61)
  Top 0.254: v47.32,58.98 47.32,49.84 v47.78,49.38 | v47.32,40.01 v47.32,42.75 | v34.06,27.66 16.23,27.66 15.77,27.2 13.49,27.2 12.57,26.29 12.57,24.46 10.74,22.63 4.57,22.63 3.89,21.95 3.89,17.83 5.03,16.69 SV1.5
  Bottom 0.254: v47.32,58.98 46.41,58.98 45.95,59.44 31.55,59.44 29.03,61.95 21.72,61.95 12.8,53.03 12.8,50.98 15.32,48.46 16.46,48.46 R11.2 | v47.78,49.38 47.78,43.2 v47.32,42.75 | v47.32,40.01 46.86,40.01 44.12,37.26 44.12,30.18 44.58,29.72 44.58,28.57 43.66,27.66 v34.06,27.66
TX2SEND
  Top 0.254: R9.2 8.69,8.91 8.69,9.37 5.26,12.8 3.89,12.8 2.74,13.95 SV1.4
TX+
  Top 0.254: IC4.6 14.17,59.66 18.06,55.78 20.34,55.78 24,52.12 R13.2
  Bottom 0.254: CN1.1 51.89,58.06 42.98,58.06 42.06,58.98 28.8,58.98 26.75,56.92 26.75,55.32 24.23,52.81 24.23,52.12 R13.2
TX-
  Top 0.254: IC4.7 11.43,59.44 17.14,53.72 17.37,53.72 18.97,52.12 R13.1
  Bottom 0.254: CN1.2 51.89,60.12 48.01,60.12 47.09,61.04 42.29,61.04 40.01,63.32 38.86,63.32 37.95,62.41 37.95,61.72 37.26,61.04 30.63,61.04 29.26,62.41 13.95,62.41 11.43,59.89 IC4.7
TXRETURN  (via drill 0.61)
  Top 0.254: v29.72,59.89 33.83,59.89 37.03,56.69 37.03,54.86 41.83,50.06 45.03,50.06 46.63,48.46 48.69,48.46 51.44,51.21 55.32,51.21 57.38,53.26 v67.67,53.26 | v67.67,21.49 64.92,18.75 v61.72,18.75
  Bottom 0.254: v29.72,59.89 23.32,59.89 21.03,57.61 21.03,53.72 24,50.75 24,48.46 R12.2 | v67.67,53.26 69.95,50.98 69.95,23.77 v67.67,21.49 | v61.72,18.75 53.72,18.75 48.01,13.03 42.52,13.03 37.49,8 28.57,8 28.35,7.77 24.92,7.77 20.57,12.12 14.86,12.12 14.17,12.8 11.66,12.8 6.63,17.83 3.89,17.83 2.74,18.97 SV1.8
TXSEND
  Top 0.254: R8.2 13.03,11.43 9.37,15.09 4.12,15.09 2.74,16.46 SV1.6
USBD+  (via drill 0.61)
  Top 0.254: v28.8,50.52 23.55,50.52 20.8,53.26 18.97,53.26 18.06,54.18 17.37,54.18 12.8,58.75 12.8,63.32 X2.P$3 | v61.95,34.98 62.18,34.75 62.18,32.92 53.95,24.69 52.12,24.69 JP2.3
  Bottom 0.254: v28.8,50.52 40.69,50.52 45.03,54.86 52.12,54.86 55.32,51.66 55.32,39.78 57.84,37.26 X1.P$3 58.06,37.26 61.27,37.26 62.18,36.35 62.18,35.66 61.95,35.43 v61.95,34.98
USBD-  (via drill 0.61)
  Top 0.254: v56.24,45.72 55.78,46.18 40.46,46.18 39.55,47.09 39.55,48.92 37.95,50.52 33.6,50.52 29.49,54.63 29.49,56.46 25.6,60.35 25.6,62.41 20.34,67.67 12.57,67.67 11.43,66.52 11.43,65.61 10.29,64.47 10.29,63.55 X2.P$2 | v59.66,40.01 59.66,38.41 60.81,37.26 60.81,36.12 X1.P$4 | v56.92,35.66 56.92,34.29 53.72,31.09 53.72,29.49 52.12,27.89 52.12,27.2 JP2.4
  Bottom 0.254: v56.24,45.72 56.24,43.43 v59.66,40.01 | v56.92,35.66 57.38,35.66 57.61,35.89 60.81,35.89 X1.P$4
VCC  (via drill 0.61)
  Top 0.254: R10.1 13.95,6.4 13.95,8.69 R9.1 | IC2.8 24.23,6.4 25.6,6.4 27.89,8.69 C2.1 | C3.1 42.98,8.91 39.32,8.91 34.29,13.95 OK1.7 | C4.1 19.2,54.41 20.34,54.41 23.77,50.98 25.83,50.98 27.89,53.03 27.89,55.78 IC3.14 | 11.66,52.12 13.95,52.12 IC4.3 | 11.66,52.12 11.43,52.12 IC4.2 11.66,52.12 | 11.66,52.12 8.91,54.86 8.91,59.66 IC4.8 | 45.72,51.89 C5.1 | 45.72,51.89 46.86,53.03 46.86,58.06 43.2,61.72 43.2,62.18 C1.1 | v41.15,52.35 45.26,52.35 45.72,51.89 | v46.86,18.97 46.86,20.8 47.78,21.72 47.78,31.32 50.98,34.52 51.89,34.52 JP2.7
  Bottom 0.254: 10.74,23.09 11.89,21.95 20.34,21.95 23.09,24.69 23.09,26.52 24.46,27.89 29.26,27.89 30.4,29.03 MC1.P$23 | 10.74,23.09 8.91,24.92 8.91,25.38 IC1.16 | 9.14,11.43 11.43,11.43 R9.1 14.17,8.69 21.72,8.69 24,6.4 IC2.8 | 9.14,11.43 R8.1 8.91,11.43 | 34.29,13.26 OK1.7 | 34.29,13.26 29.95,8.91 28.12,8.91 C2.1 | 10.74,23.09 8.46,20.8 7.54,20.8 5.71,22.63 2.06,22.63 1.37,21.95 1.37,18.75 2.52,17.6 2.97,17.6 3.89,16.69 3.89,16.23 5.03,15.09 5.49,15.09 9.14,11.43 | C4.1 19.2,54.41 19.2,53.49 21.49,51.21 21.49,49.61 21.03,49.15 19.66,49.15 19.2,49.61 16.46,49.61 14.17,51.89 IC4.3 | 54.41,35.66 57.84,32.23 X1.P$7 | 54.41,35.66 53.03,35.66 52.12,34.75 JP2.7 | 54.41,35.66 54.41,37.03 54.63,37.26 54.63,39.09 54.18,39.55 54.18,47.09 52.58,48.69 51.44,48.69 49.15,50.98 49.15,51.21 48.69,51.66 46.41,51.66 45.72,50.98 C5.1 | v41.15,52.35 40.46,51.66 27.43,51.66 26.06,53.03 26.06,53.95 27.89,55.78 IC3.14 | 34.29,13.26 36.12,13.26 36.58,12.8 40.69,12.8 v46.86,18.97
VDD  (via drill 0.61)
  Top 0.254: 34.29,62.18 31.77,62.18 JP1.1 | v57.84,30.63 59.66,32.46 59.66,37.72 58.06,39.32 58.06,39.78 X1.P$1 | v38.18,23.55 38.18,29.03 MC1.P$20 | 34.29,62.18 35.2,62.18 36.35,61.04 39.78,61.04 41.83,63.09 v41.83,63.78 | v69.04,50.52 69.04,34.75 69.49,34.29 69.49,21.26 63.55,15.32 57.38,15.32 53.26,19.43 52.12,19.43 JP2.1 | 34.29,62.18 JP1.3
  Bottom 0.254: v57.84,30.63 57.84,25.38 52.12,19.66 JP2.1 51.89,19.66 51.21,20.34 46.18,20.34 43.66,17.83 40.23,17.83 38.18,19.89 v38.18,23.55 | v41.83,63.78 50.29,63.78 51.66,65.15 54.41,65.15 v69.04,50.52
XMIDIRX
  Top 0.254: IC2.1 24,14.17 23.55,14.17 21.72,16 15.77,16 14.17,17.6 IC1.3

### Text on the board
Document: 1 | 1 | 1 | PINEAPPLE II NITROGEN 14 / REVISION 1.0.0 (2015)